# Altium schematic sheet RelayPowerStage.SchDoc
size A4
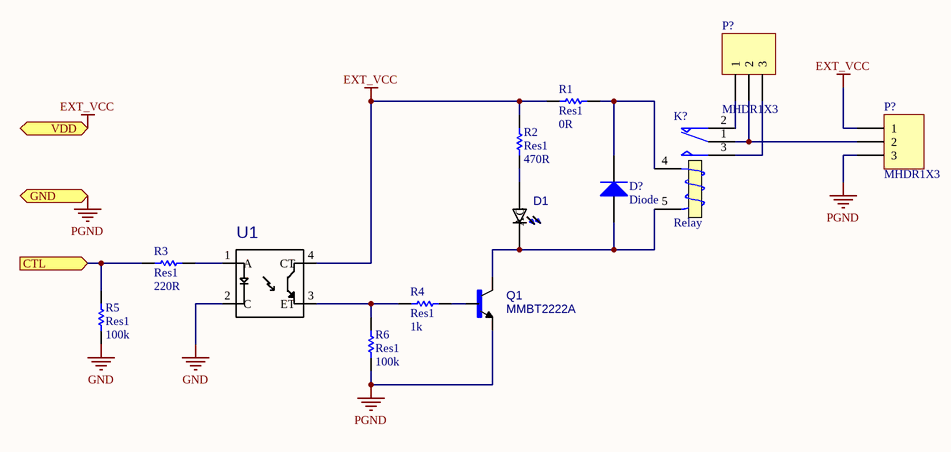
[diagram p0: RelayPowerStage.SchDoc]

## Parts
(Parts that share a designator on the sheet are numbered #1, #2 ... from top to bottom, then left to right.)
D1  0805_LED  [LEDSC200X125X70-2N_598-8160-107F(Primary)]  (value not drawn)
D?  Diode  [S1JL]
K?  Relay  [OUAZ-SH-112L (Mini Relay)]
P?#1  MHDR1X3  [MHDR1X3]
P?#2  MHDR1X3  [MHDR1X3]
Q1  MMBT2222A  [SOT23]
R1  Res1  value 0R  [6-0805_N]
R2  Res1  value 470R  [6-0805_N]
R3  Res1  value 220R  [6-0805_N]
R4  Res1  value 1k  [6-0805_N]
R5  Res1  value 100k  [6-0805_N]
R6  Res1  value 100k  [6-0805_N]
U1  PC817X2NIP0F  [SOT254P975X400-4N]  (value not drawn)

## Ports
CTL (in), GND (in), VDD (in)

## Nets
EXT_VCC: P?#2.1 R1.1 R2.1 U1.4(CT) ; port VDD
GND: R5.2 U1.2(C)
PGND: P?#2.3 Q1.2(E) R6.2 ; port GND
CTL: R3.1 R5.1 ; port CTL
NetD1_A: D1.A R2.2
NetD1_C: D1.C D?.1(A) K?.5(T2) Q1.3(C)
NetD?_2: D?.2(K) K?.4(T1) R1.2
NetK?_1: K?.1(COM) P?#1.2 P?#2.2
NetK?_2: K?.2(NC) P?#1.1
NetK?_3: K?.3(NO) P?#1.3
NetQ1_1: Q1.1(B) R4.2
NetR3_2: R3.2 U1.1(A)
NetR4_1: R4.1 R6.1 U1.3(ET)

## Library data of the parts
D1 = 598-8160-107F: LED, SMD; 0805; Yellow-Green; Water Clear Lens; 40mcd; 570/575nm; MF: Dialight; Package: 0805 Dialight; MP: 598-8160-107F; Price: 0.09 USD; Availability: Good; Value: *
D? = Diode: Default Diode; Published: 8-Jun-2000; LatestRevisionDate: 17-Jul-2002; LatestRevisionNote: Re-released for DXP Platform.; PackageVersion: Sep-1996; PackageReference: SMC; Publisher: Altium Limited; PackageDescription: DO-214-AB/SMC; 2 C-Bend Leads; Body 7.9 x 5.9 mm, inc. leads (LxW); Code_JEDEC: DO-214-AB
K? = Relay: SPDT Relay; Published: 8-Jun-2000; LatestRevisionDate: 17-Jul-2002; LatestRevisionNote: Re-released for DXP Platform.; PackageReference: MODULE5B; Publisher: Altium Limited; Datasheet: http://au.element14.com/te-connectivity/ouaz-sh-112l/relay-signal-spdt-120vac-24vdc/dp/1197687
P?#1 P?#2 = MHDR1X3: Header, 3-Pin; LatestRevisionDate: 17-Jul-2002; LatestRevisionNote: Re-released for DXP Platform.; Publisher: Altium Limited
Q1 = MMBT2222A: MMBT2222 Series 40 V CE Breakdown 1 A NPN General Purpose Amplifier - SOT-23; MF: Fairchild Semiconductor; Package: SOT-23 Fairchild Semiconductor; MP: MMBT2222A; Price: 0.06 USD; Availability: Good; Value: *
R1-R6 = Res1: Resistor; Published: 8-Jun-2000; LatestRevisionDate: 17-Jul-2002; LatestRevisionNote: Re-released for DXP Platform.; PackageReference: AXIAL-0.3; Publisher: Altium Limited; PackageDescription: Axial Device, Thru-Hole; 2 Leads; 0.3 in Pin Spacing
U1 = PC817X2NIP0F: PC817 Series 1 Channel 80 V 5000 Vrms General Purpose Photocoupler - DIP-4; MF: Sharp Microelectronics; Availability: Good; Price: 0.30 USD; Package: PDIP-4 Sharp Microelectronics; MP: PC817X2NIP0F; Value: *